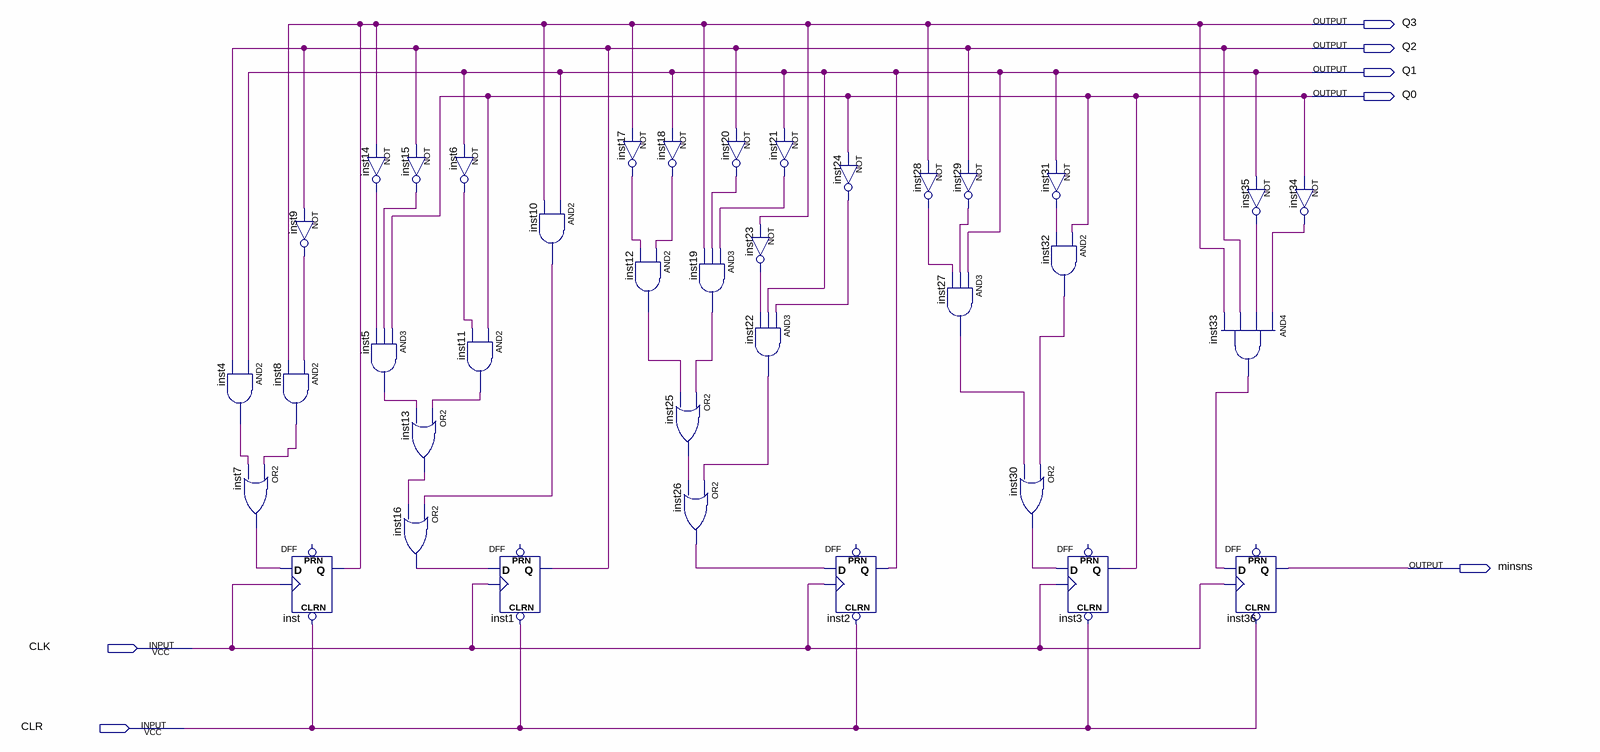
[diagram p0: schematic sheet]
// Quartus schematic MinorSense.bdf as structural Verilog: 37 symbols, 7 pins
module MinorSense (
  input  CLK,
  input  CLR,
  output Q3,
  output Q2,
  output Q1,
  output Q0,
  output minsns
);

  wire inst4_out, inst5_out, inst6_out, inst7_out, inst8_out, inst9_out, inst10_out, inst11_out, inst12_out,
       inst13_out, inst14_out, inst15_out, inst16_out, inst17_out, inst18_out, inst19_out, inst20_out,
       inst21_out, inst22_out, inst23_out, inst24_out, inst25_out, inst26_out, inst27_out, inst28_out,
       inst29_out, inst30_out, inst31_out, inst32_out, inst33_out, inst34_out, inst35_out;

  and inst4 (inst4_out, Q1, Q2);
  not inst9 (inst9_out, Q2);
  and inst8 (inst8_out, inst9_out, Q3);
  or inst7 (inst7_out, inst8_out, inst4_out);
  DFF inst (.CLRN(CLR), .CLK(CLK), .D(inst7_out), .Q(Q3));  // open: PRN
  not inst14 (inst14_out, Q3);
  not inst15 (inst15_out, Q2);
  and inst5 (inst5_out, Q0, inst15_out, inst14_out);
  or inst13 (inst13_out, inst11_out, inst5_out);
  or inst16 (inst16_out, inst10_out, inst13_out);
  not inst6 (inst6_out, Q1);
  and inst11 (inst11_out, Q0, inst6_out);
  and inst10 (inst10_out, Q1, Q3);
  DFF inst1 (.CLRN(CLR), .CLK(CLK), .D(inst16_out), .Q(Q2));  // open: PRN
  not inst17 (inst17_out, Q3);
  not inst18 (inst18_out, Q1);
  and inst12 (inst12_out, inst18_out, inst17_out);
  or inst25 (inst25_out, inst19_out, inst12_out);
  or inst26 (inst26_out, inst22_out, inst25_out);
  not inst20 (inst20_out, Q2);
  and inst19 (inst19_out, inst21_out, inst20_out, Q3);
  not inst21 (inst21_out, Q1);
  not inst23 (inst23_out, Q3);
  and inst22 (inst22_out, inst24_out, Q1, inst23_out);
  not inst24 (inst24_out, Q0);
  DFF inst2 (.CLRN(CLR), .CLK(CLK), .D(inst26_out), .Q(Q1));  // open: PRN
  not inst28 (inst28_out, Q3);
  not inst29 (inst29_out, Q2);
  and inst27 (inst27_out, Q1, inst29_out, inst28_out);
  not inst31 (inst31_out, Q1);
  and inst32 (inst32_out, Q0, inst31_out);
  or inst30 (inst30_out, inst32_out, inst27_out);
  DFF inst3 (.CLRN(CLR), .CLK(CLK), .D(inst30_out), .Q(Q0));  // open: PRN
  not inst35 (inst35_out, Q1);
  and inst33 (inst33_out, inst34_out, inst35_out, Q2, Q3);
  DFF inst36 (.CLRN(CLR), .CLK(CLK), .D(inst33_out), .Q(minsns));  // open: PRN
  not inst34 (inst34_out, Q0);
endmodule
